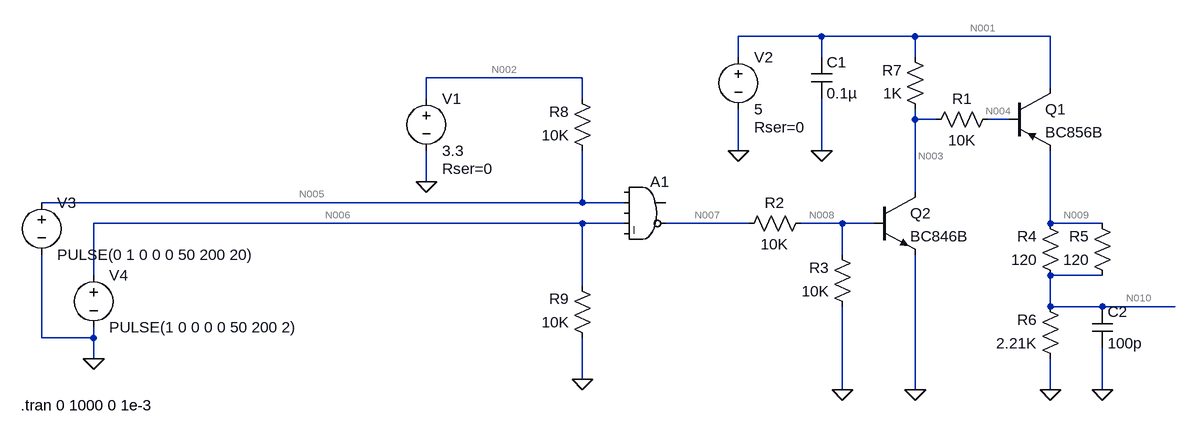
[diagram p0: schematic PPNand.asc]
PPNand.asc, the LTspice schematic file:
Version 4
SHEET 1 880 680
WIRE -96 -48 -224 -48
WIRE 48 -48 -96 -48
WIRE 256 -48 48 -48
WIRE -224 -16 -224 -48
WIRE -96 -16 -96 -48
WIRE 48 -16 48 -48
WIRE -464 16 -704 16
WIRE 256 32 256 -48
WIRE -704 48 -704 16
WIRE -464 48 -464 16
WIRE 48 80 48 64
WIRE 80 80 48 80
WIRE 192 80 160 80
WIRE -224 128 -224 64
WIRE -96 128 -96 48
WIRE -704 176 -704 128
WIRE 48 192 48 80
WIRE -464 208 -464 128
WIRE -464 208 -1296 208
WIRE -400 208 -464 208
WIRE -464 240 -1216 240
WIRE -400 240 -464 240
WIRE -208 240 -336 240
WIRE -64 240 -128 240
WIRE -16 240 -64 240
WIRE 256 240 256 128
WIRE 336 240 256 240
WIRE -64 288 -64 240
WIRE -1216 320 -1216 240
WIRE 336 320 256 320
WIRE -464 336 -464 240
WIRE 256 368 256 320
WIRE 336 368 256 368
WIRE 448 368 336 368
WIRE -1296 416 -1296 288
WIRE -1216 416 -1216 400
WIRE -1216 416 -1296 416
WIRE -1216 448 -1216 416
WIRE -464 480 -464 416
WIRE -64 496 -64 368
WIRE 48 496 48 288
WIRE 256 496 256 448
WIRE 336 496 336 432
FLAG -464 480 0
FLAG 256 496 0
FLAG 336 496 0
FLAG -64 496 0
FLAG -96 128 0
FLAG 48 496 0
FLAG -224 128 0
FLAG -704 176 0
FLAG -1216 448 0
SYMBOL pnp 192 32 R0
SYMATTR InstName Q1
SYMATTR Value BC856B
SYMBOL npn -16 192 R0
SYMATTR InstName Q2
SYMATTR Value BC846B
SYMBOL res 176 64 R90
WINDOW 0 0 56 VBottom 2
WINDOW 3 32 56 VTop 2
SYMATTR InstName R1
SYMATTR Value 10K
SYMATTR SpiceLine tol=1 pwr=0.1
SYMBOL res -112 224 R90
WINDOW 0 0 56 VBottom 2
WINDOW 3 32 56 VTop 2
SYMATTR InstName R2
SYMATTR Value 10K
SYMATTR SpiceLine tol=1 pwr=0.1
SYMBOL res -48 384 R180
WINDOW 0 36 76 Left 2
WINDOW 3 36 40 Left 2
SYMATTR InstName R3
SYMATTR Value 10K
SYMATTR SpiceLine tol=1 pwr=0.1
SYMBOL res 272 336 R180
WINDOW 0 36 76 Left 2
WINDOW 3 36 40 Left 2
SYMATTR InstName R4
SYMATTR Value 120
SYMBOL res 352 336 R180
WINDOW 0 36 76 Left 2
WINDOW 3 36 40 Left 2
SYMATTR InstName R5
SYMATTR Value 120
SYMBOL res 272 464 R180
WINDOW 0 36 76 Left 2
WINDOW 3 36 40 Left 2
SYMATTR InstName R6
SYMATTR Value 2.21K
SYMATTR SpiceLine tol=1 pwr=0.1
SYMBOL res 64 80 R180
WINDOW 0 36 76 Left 2
WINDOW 3 36 40 Left 2
SYMATTR InstName R7
SYMATTR Value 1K
SYMATTR SpiceLine tol=1 pwr=0.1
SYMBOL res -448 144 R180
WINDOW 0 36 76 Left 2
WINDOW 3 36 40 Left 2
SYMATTR InstName R8
SYMATTR Value 10K
SYMATTR SpiceLine tol=1 pwr=0.1
SYMBOL res -448 432 R180
WINDOW 0 36 76 Left 2
WINDOW 3 36 40 Left 2
SYMATTR InstName R9
SYMATTR Value 10K
SYMATTR SpiceLine tol=1 pwr=0.1
SYMBOL cap -112 -16 R0
SYMATTR InstName C1
SYMATTR Value 0.1µ
SYMATTR SpiceLine V=4 Irms=0 Rser=0 Lser=0 mfg="Murata" pn="GRM022R60G153KE15" type="X5R"
SYMBOL cap 320 368 R0
SYMATTR InstName C2
SYMATTR Value 100p
SYMATTR SpiceLine V=10 Irms=0 Rser=0.8826 Lser=319p mfg="Würth Elektronik" pn="885012207004 WCAP-CSGP 0805" type="X7R"
SYMBOL Digital\\and -368 160 R0
SYMATTR InstName A1
SYMBOL voltage -704 32 R0
WINDOW 123 0 0 Left 0
WINDOW 39 24 124 Left 2
SYMATTR InstName V1
SYMATTR Value 3.3
SYMATTR SpiceLine Rser=0
SYMBOL voltage -224 -32 R0
WINDOW 123 0 0 Left 0
WINDOW 39 24 124 Left 2
SYMATTR InstName V2
SYMATTR Value 5
SYMATTR SpiceLine Rser=0
SYMBOL voltage -1296 192 R0
WINDOW 123 0 0 Left 0
WINDOW 39 0 0 Left 0
SYMATTR InstName V3
SYMATTR Value PULSE(0 1 0 0 0 50 200 20)
SYMBOL voltage -1216 304 R0
WINDOW 123 0 0 Left 0
WINDOW 39 0 0 Left 0
SYMATTR InstName V4
SYMATTR Value PULSE(1 0 0 0 0 50 200 2)
TEXT -1328 520 Left 2 !.tran 0 1000 0 1e-3

The netlist it stands for:
* PPNand.asc
Q1 N001 N004 N009 0 BC856B
Q2 N003 N008 0 0 BC846B
R1 N004 N003 10K tol=1 pwr=0.1
R2 N008 N007 10K tol=1 pwr=0.1
R3 0 N008 10K tol=1 pwr=0.1
R4 N010 N009 120
R5 N010 N009 120
R6 0 N010 2.21K tol=1 pwr=0.1
R7 N003 N001 1K tol=1 pwr=0.1
R8 N005 N002 10K tol=1 pwr=0.1
R9 0 N006 10K tol=1 pwr=0.1
C1 N001 0 0.1µ V=4 Irms=0 Rser=0 Lser=0 mfg="Murata" pn="GRM022R60G153KE15" type="X5R"
C2 N010 0 100p V=10 Irms=0 Rser=0.8826 Lser=319p mfg="Würth Elektronik" pn="885012207004 WCAP-CSGP 0805" type="X7R"
A1 0 N005 0 N006 0 N007 0 0 AND
V1 N002 0 3.3 Rser=0
V2 N001 0 5 Rser=0
V3 N005 0 PULSE(0 1 0 0 0 50 200 20)
V4 N006 0 PULSE(1 0 0 0 0 50 200 2)
.model NPN NPN
.model PNP PNP
.lib standard.bjt
.tran 0 1000 0 1e-3
.backanno
.end

* Results of the author's LTspice run, read from the files saved beside the schematic
* Operating Point, zero values left out:
*   V(n001) = 5 V
*   V(n004) = 4.995 V
*   V(n009) = 11.44 nV
*   V(n003) = 4.995 V
*   V(n008) = 499.9 mV
*   V(n007) = 999.9 mV
*   V(n010) = 11.14 nV
*   V(n002) = 3.3 V
*   V(n006) = 1 V
*   Ib(Q1) = 4.992 pA
*   Ie(Q1) = -5.039 pA
*   Ic(Q2) = 5.28 µA
*   Ib(Q2) = 16.12 nA
*   Ie(Q2) = -5.296 µA
*   I(R1) = -4.992 pA
*   I(R2) = -50.01 µA
*   I(R3) = -49.99 µA
*   I(R4) = -2.52 pA
*   I(R5) = -2.52 pA
*   I(R6) = -5.039 pA
*   I(R7) = -5.28 µA
*   I(R8) = -330 µA
*   I(R9) = -100 µA
*   I(V1) = -330 µA
*   I(V2) = -5.28 µA
*   I(V3) = 330 µA
*   I(V4) = -100 µA
*   I8(A1) = 50.01 µA
*   I6(A1) = -50.01 µA
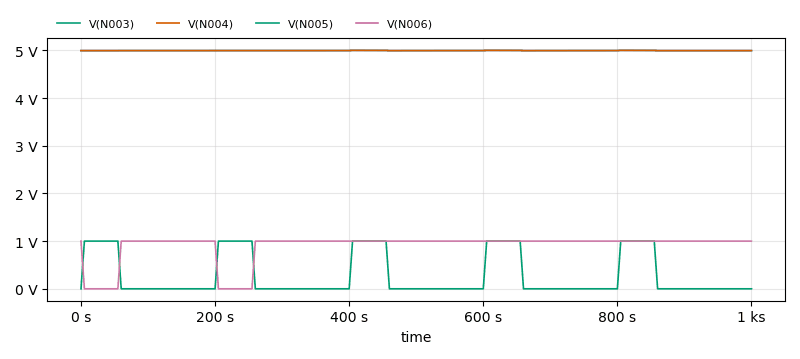
[diagram p1: Transient Analysis of PPNand.asc, plotted from the saved traces]
* Transient Analysis, 1 run:
*   V(N003): min 4.995 V, max 5 V, average 4.996 V, rms 4.996 V, last 4.995 V
*   V(N004): min 4.995 V, max 5 V, average 4.996 V, rms 4.996 V, last 4.995 V
*   V(N005): min 0 V, max 1.001 V, average 275 mV, rms 516.7 mV, last 0 V
*   V(N006): min 0 V, max 1 V, average 890 mV, rms 941.7 mV, last 1 V